# EAGLE schematic fabftdi-ch340g (EAGLE 8.2.2)
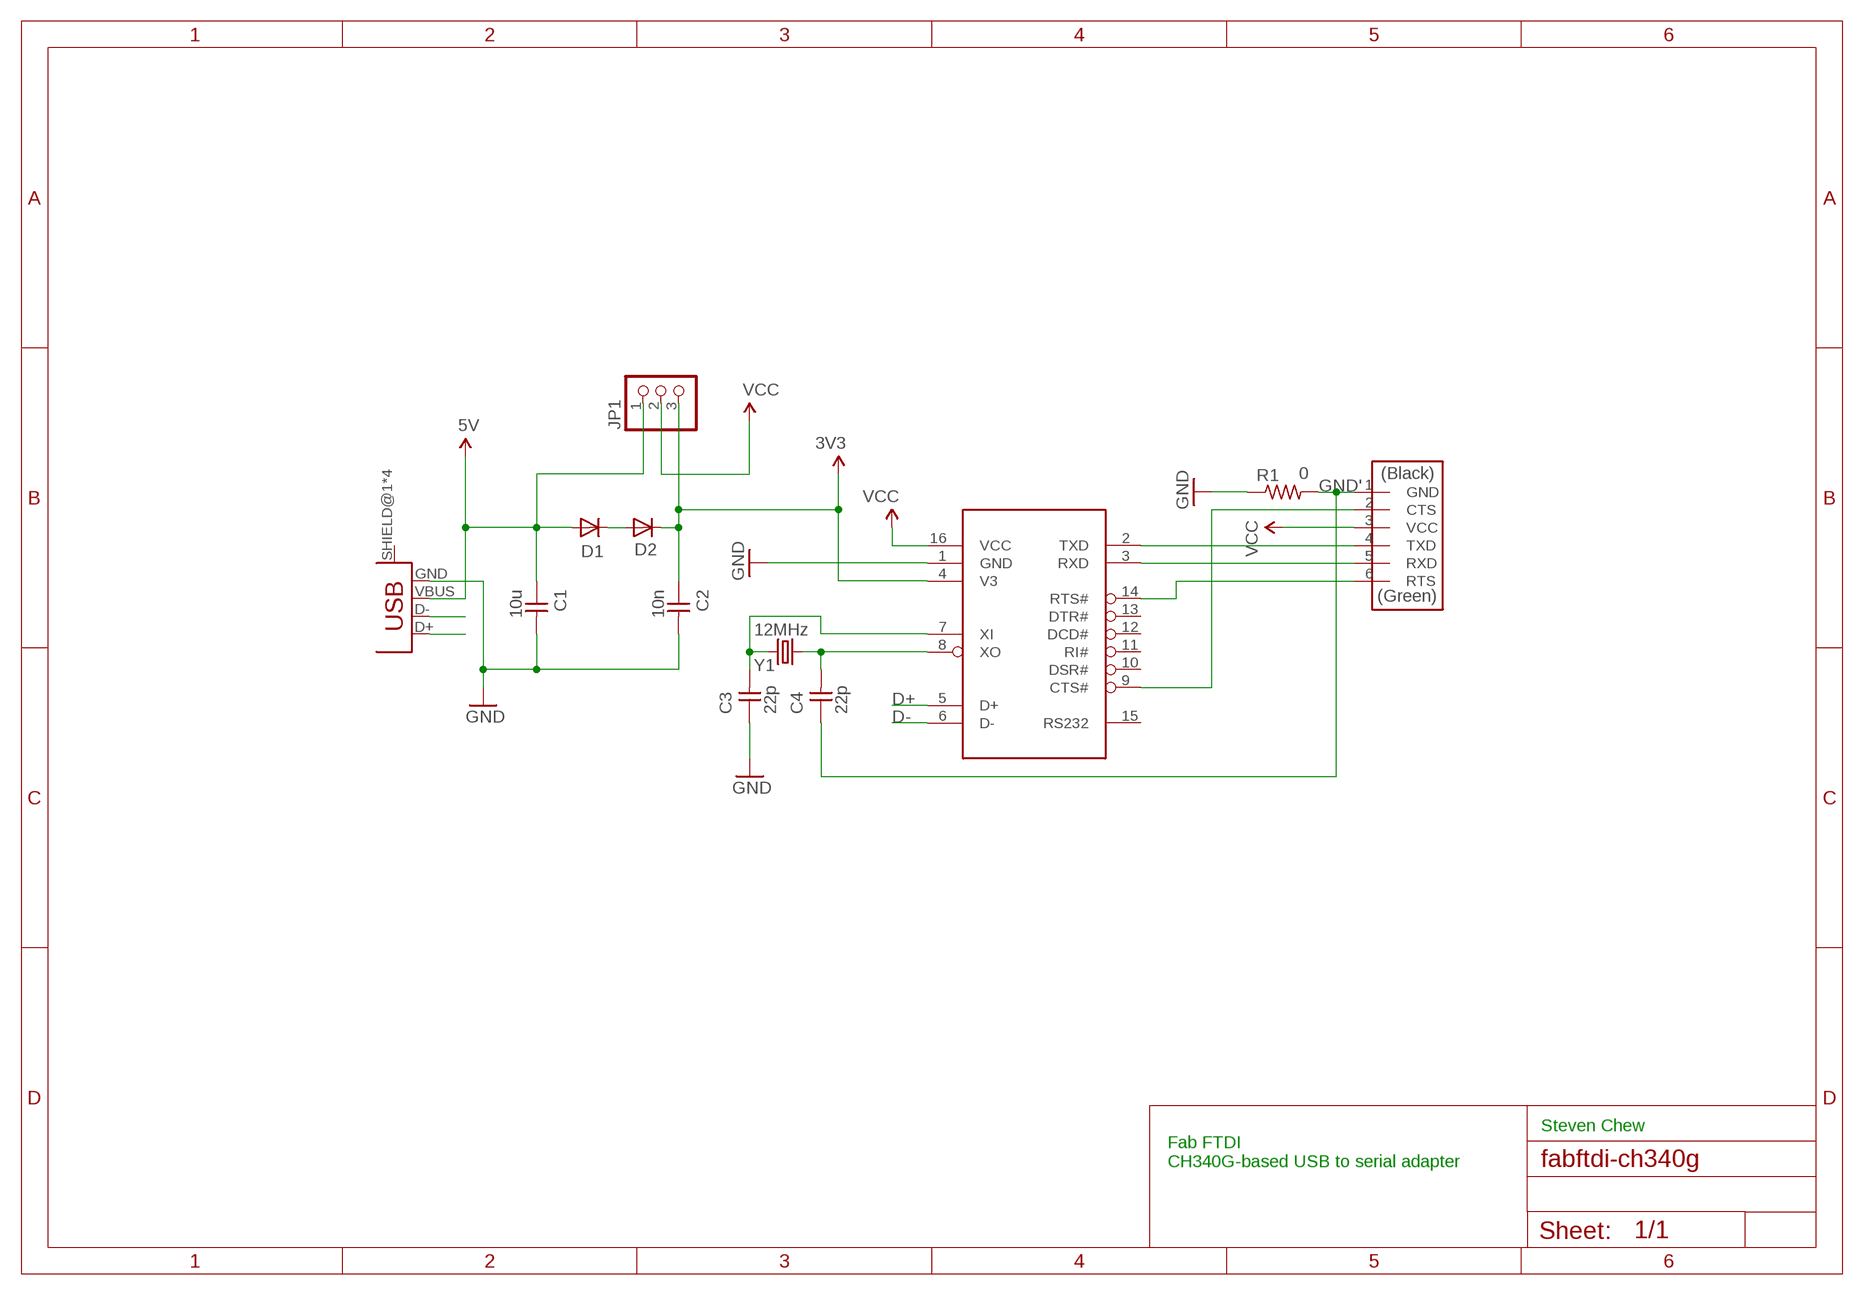
[diagram p0: schematic, sheet 1]

## Parts
C1  10u  CAP-UNPOLARIZEDFAB  [C1206FAB]
C2  10n  CAP-UNPOLARIZEDFAB  [C1206FAB]
C3  22p  CAP-UNPOLARIZEDFAB  [C1206FAB]
C4  22p  CAP-UNPOLARIZEDFAB  [C1206FAB]
D1  DIODESOD123  [SOD123]
D2  DIODESOD123  [SOD123]
JP1  PINHD-1X3  [1X03]
R1  0  RES-US1206FAB  [R1206FAB]
U1  CH340G  [SOIC16]
U$1  FTDI-SMD-HEADER  [1X06SMD]
U$2  USB_MINIB  [USB_MINIB]
Y1  12MHz  CRYSTAL10.5X4.8  [CRYSTAL-SMD-10.5X4.8-2PIN]

## Nets
3V3: C2.1 D2.CATHODE(C) JP1.3 U1.4(V3)
5V: C1.1 D1.ANODE(A) JP1.1 U$2.VBUS
D+: U1.5(D+) U$2.D+
D-: U1.6(D-) U$2.D-
GND: C1.2 C2.2 C3.1 R1.1 U1.1(GND) U$2.GND
GND': C4.1 R1.2 U$1.1(GND)
N$1: C4.2 U1.8(XO) Y1.P$1
N$2: C3.2 U1.7(XI) Y1.P$2
N$4: D1.CATHODE(C) D2.ANODE(A)
N$9: U1.9(CTS#) U$1.2(CTS)
N$10: U1.2(TXD) U$1.4(TXD)
N$11: U1.3(RXD) U$1.5(RXD)
N$12: U1.14(RTS#) U$1.6(RTS)
VCC: JP1.2 U1.16(VCC) U$1.3(VCC)
Unconnected: U1.10(DSR#) U1.11(RI#) U1.12(DCD#) U1.13(DTR#) U1.15(RS232) U$2.SHIELD@1(SHIELD) U$2.SHIELD@2(SHIELD) U$2.SHIELD@3(SHIELD) U$2.SHIELD@4(SHIELD)

## Notes on the sheet
- Steven Chew
- Fab FTDI
  CH340G-based USB to serial adapter

## Library data of the parts
C1-C4 = 00fab:CAP-UNPOLARIZED
D1 D2 = 00fab:DIODE: DIODE high speed (Philips)
JP1 = pinhead:PINHD-1X3: PIN HEADER
R1 = 00fab:RES-US: Resistor (US Symbol) Variants with postfix FAB are widened to allow the routing of internal traces
U1 = 00fab:CH340G: CH340G USB to TTL converter SOIC-16 packaging
U$1 = 00fab:FTDI-SMD-HEADER
U$2 = 00fab:USB_MINIB
Y1 = SparkFun-FreqCtrl:CRYSTAL: Various standard crystals. Proven footprints.